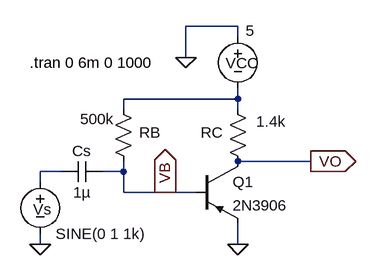
[diagram p0: schematic fig6_14a_AC-1DC-voltage_source__interesting01.asc]
fig6_14a_AC-1DC-voltage_source__interesting01.asc, the LTspice schematic file:
Version 4
SHEET 1 880 680
WIRE 256 -96 176 -96
WIRE 256 -80 256 -96
WIRE 176 -48 176 -96
WIRE 256 16 256 0
WIRE 256 16 80 16
WIRE 80 32 80 16
WIRE 256 32 256 16
WIRE 368 112 256 112
WIRE -16 128 -48 128
WIRE 80 128 80 112
WIRE 80 128 48 128
WIRE -48 144 -48 128
WIRE 80 160 80 128
WIRE 144 160 80 160
WIRE 192 160 144 160
WIRE -48 240 -48 224
WIRE 256 240 256 208
FLAG 256 240 0
FLAG 176 -48 0
FLAG 368 112 VO
IOPIN 368 112 Out
FLAG 144 160 VB
IOPIN 144 160 Out
FLAG -48 240 0
SYMBOL pnp 192 112 R0
SYMATTR InstName Q1
SYMATTR Value 2N3906
SYMBOL res 240 16 R0
WINDOW 0 -41 52 Left 2
WINDOW 3 44 35 Left 2
SYMATTR InstName RC
SYMATTR Value 1.4k
SYMBOL res 96 128 R180
WINDOW 0 -41 60 Left 2
WINDOW 3 30 81 Left 2
SYMATTR InstName RB
SYMATTR Value 500k
SYMBOL voltage 256 -96 R0
WINDOW 0 -19 57 Left 2
WINDOW 3 12 7 Left 2
SYMATTR InstName VCC
SYMATTR Value 5
SYMBOL voltage -48 128 R0
WINDOW 0 -11 58 Left 2
WINDOW 123 0 0 Left 0
WINDOW 39 0 0 Left 0
SYMATTR InstName Vs
SYMATTR Value SINE(0 1 1k)
SYMBOL cap 48 112 R90
WINDOW 0 0 32 VBottom 2
WINDOW 3 32 32 VTop 2
SYMATTR InstName Cs
SYMATTR Value 1µ
TEXT -64 -40 Left 2 !.tran 0 6m 0 1000

The netlist it stands for:
* fig6_14a_AC-1DC-voltage_source__interesting01.asc
Q1 VO VB 0 0 2N3906
RC N001 VO 1.4k
RB VB N001 500k
VCC 0 N001 5
Vs N002 0 SINE(0 1 1k)
Cs VB N002 1µ
.model NPN NPN
.model PNP PNP
.lib standard.bjt
.tran 0 6m 0 1000
.backanno
.end